# Altium schematic sheet HEATER.SchDoc: HEATER
size A3; Date: 13/11/2025; DrawnBy: Văn Quý Tuân; SheetNumber: 7; SheetTotal: 10; Size: A3; Subsystem: HW-11/11/25
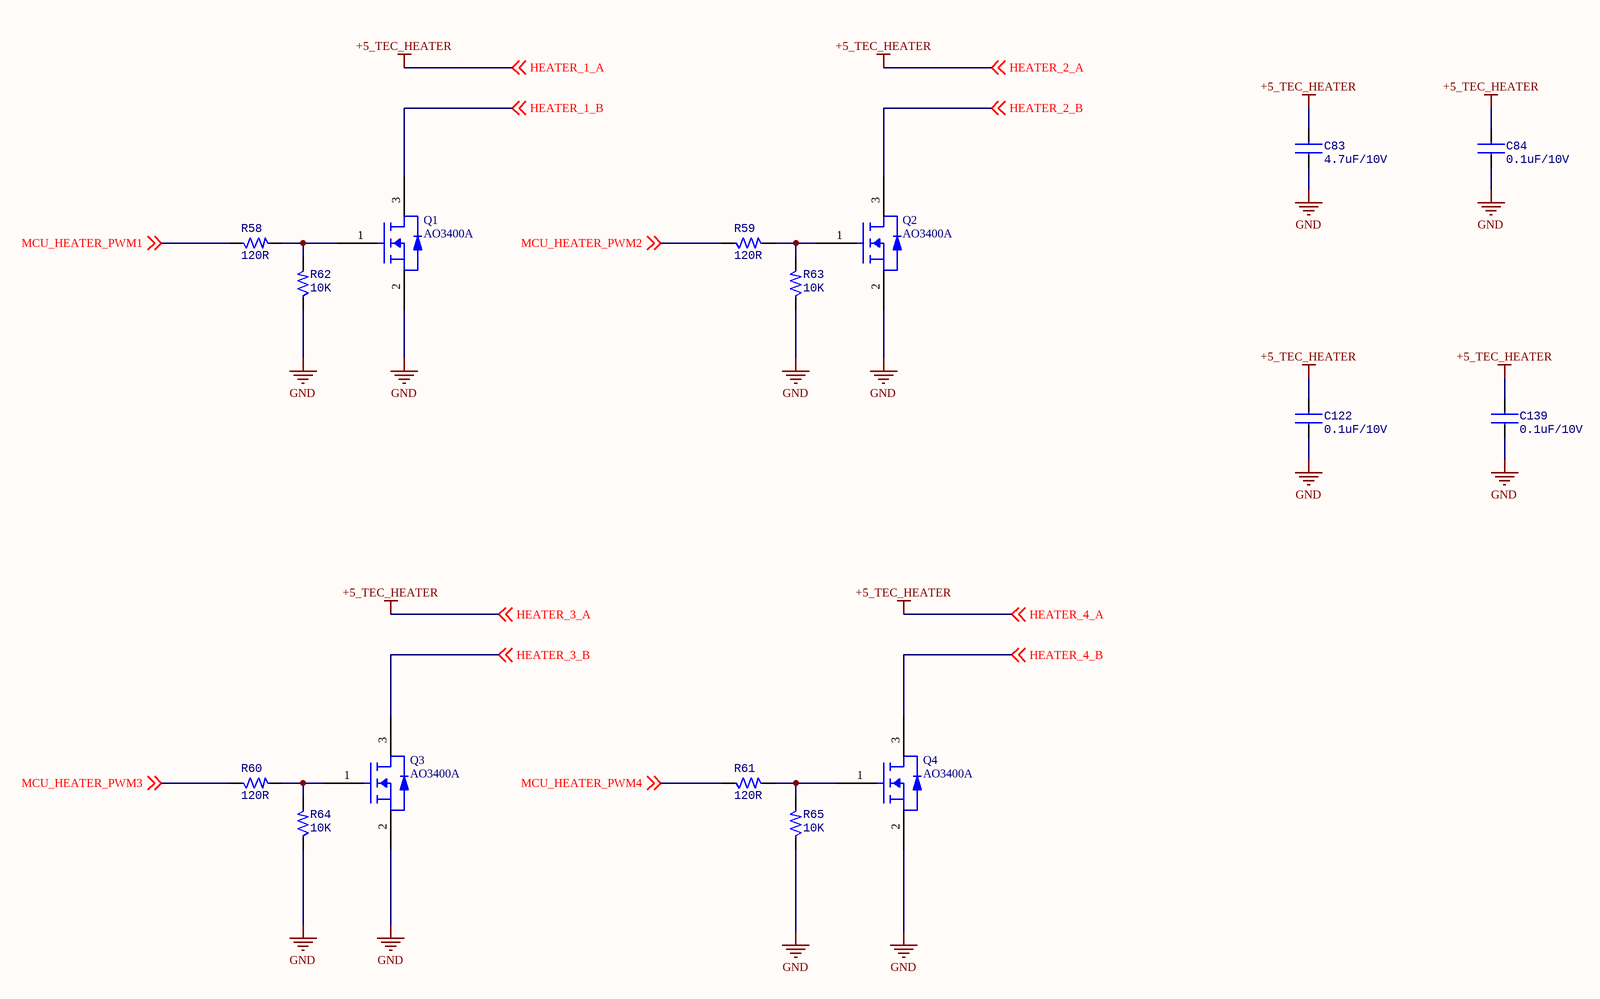
[diagram p0: HEATER.SchDoc]

## Parts
C83  4.7uF/10V  [CAP-CER-0603]
C84  0.1uF/10V  [CAP-CER-0603]
C122  0.1uF/10V  [CAP-CER-0603]
C139  0.1uF/10V  [CAP-CER-0603]
Q1  AO3400A  [SOT-23]
Q2  AO3400A  [SOT-23]
Q3  AO3400A  [SOT-23]
Q4  AO3400A  [SOT-23]
R58  120R  [RES-SMD-0603]
R59  120R  [RES-SMD-0603]
R60  120R  [RES-SMD-0603]
R61  120R  [RES-SMD-0603]
R62  10K  [RES-SMD-0603]
R63  10K  [RES-SMD-0603]
R64  10K  [RES-SMD-0603]
R65  10K  [RES-SMD-0603]

## Nets
+5_TEC_HEATER: C83.1 C84.1 C122.1 C139.1 ; off-sheet HEATER_1_A, off-sheet HEATER_2_A, off-sheet HEATER_3_A, off-sheet HEATER_4_A  [also labelled HEATER_1_A, HEATER_2_A, HEATER_3_A, HEATER_4_A]
GND: C83.2 C84.2 C122.2 C139.2 Q1.2 Q2.2 Q3.2 Q4.2 R62.1 R63.1 R64.1 R65.1
HEATER_1_B: Q1.3 ; off-sheet HEATER_1_B
HEATER_2_B: Q2.3 ; off-sheet HEATER_2_B
HEATER_3_B: Q3.3 ; off-sheet HEATER_3_B
HEATER_4_B: Q4.3 ; off-sheet HEATER_4_B
MCU_HEATER_PWM1: R58.1 ; off-sheet MCU_HEATER_PWM1
MCU_HEATER_PWM2: R59.1 ; off-sheet MCU_HEATER_PWM2
MCU_HEATER_PWM3: R60.1 ; off-sheet MCU_HEATER_PWM3
MCU_HEATER_PWM4: R61.1 ; off-sheet MCU_HEATER_PWM4
NetQ1_1: Q1.1 R58.2 R62.2
NetQ2_1: Q2.1 R59.2 R63.2
NetQ3_1: Q3.1 R60.2 R64.2
NetQ4_1: Q4.1 R61.2 R65.2

## Notes on the sheet
- Project:
- Sub-system:
- Checked by:
- Design by:
- Sheet title:
- Doc no:
- Sheet
- Size
- Approved by:
- Revision:
- Date
- Text

## Library data of the parts
C83 C84 C122 C139 = CAP-CER
Q1-Q4 = 2N7002NXAKR: MOSFET N-Channel Vds=60V Id=300mA with ESD Protection; Manufacturer: Nexperia; Manufacturer Part Number: 2N7002NXAKR
R58-R65 = RES-SMD